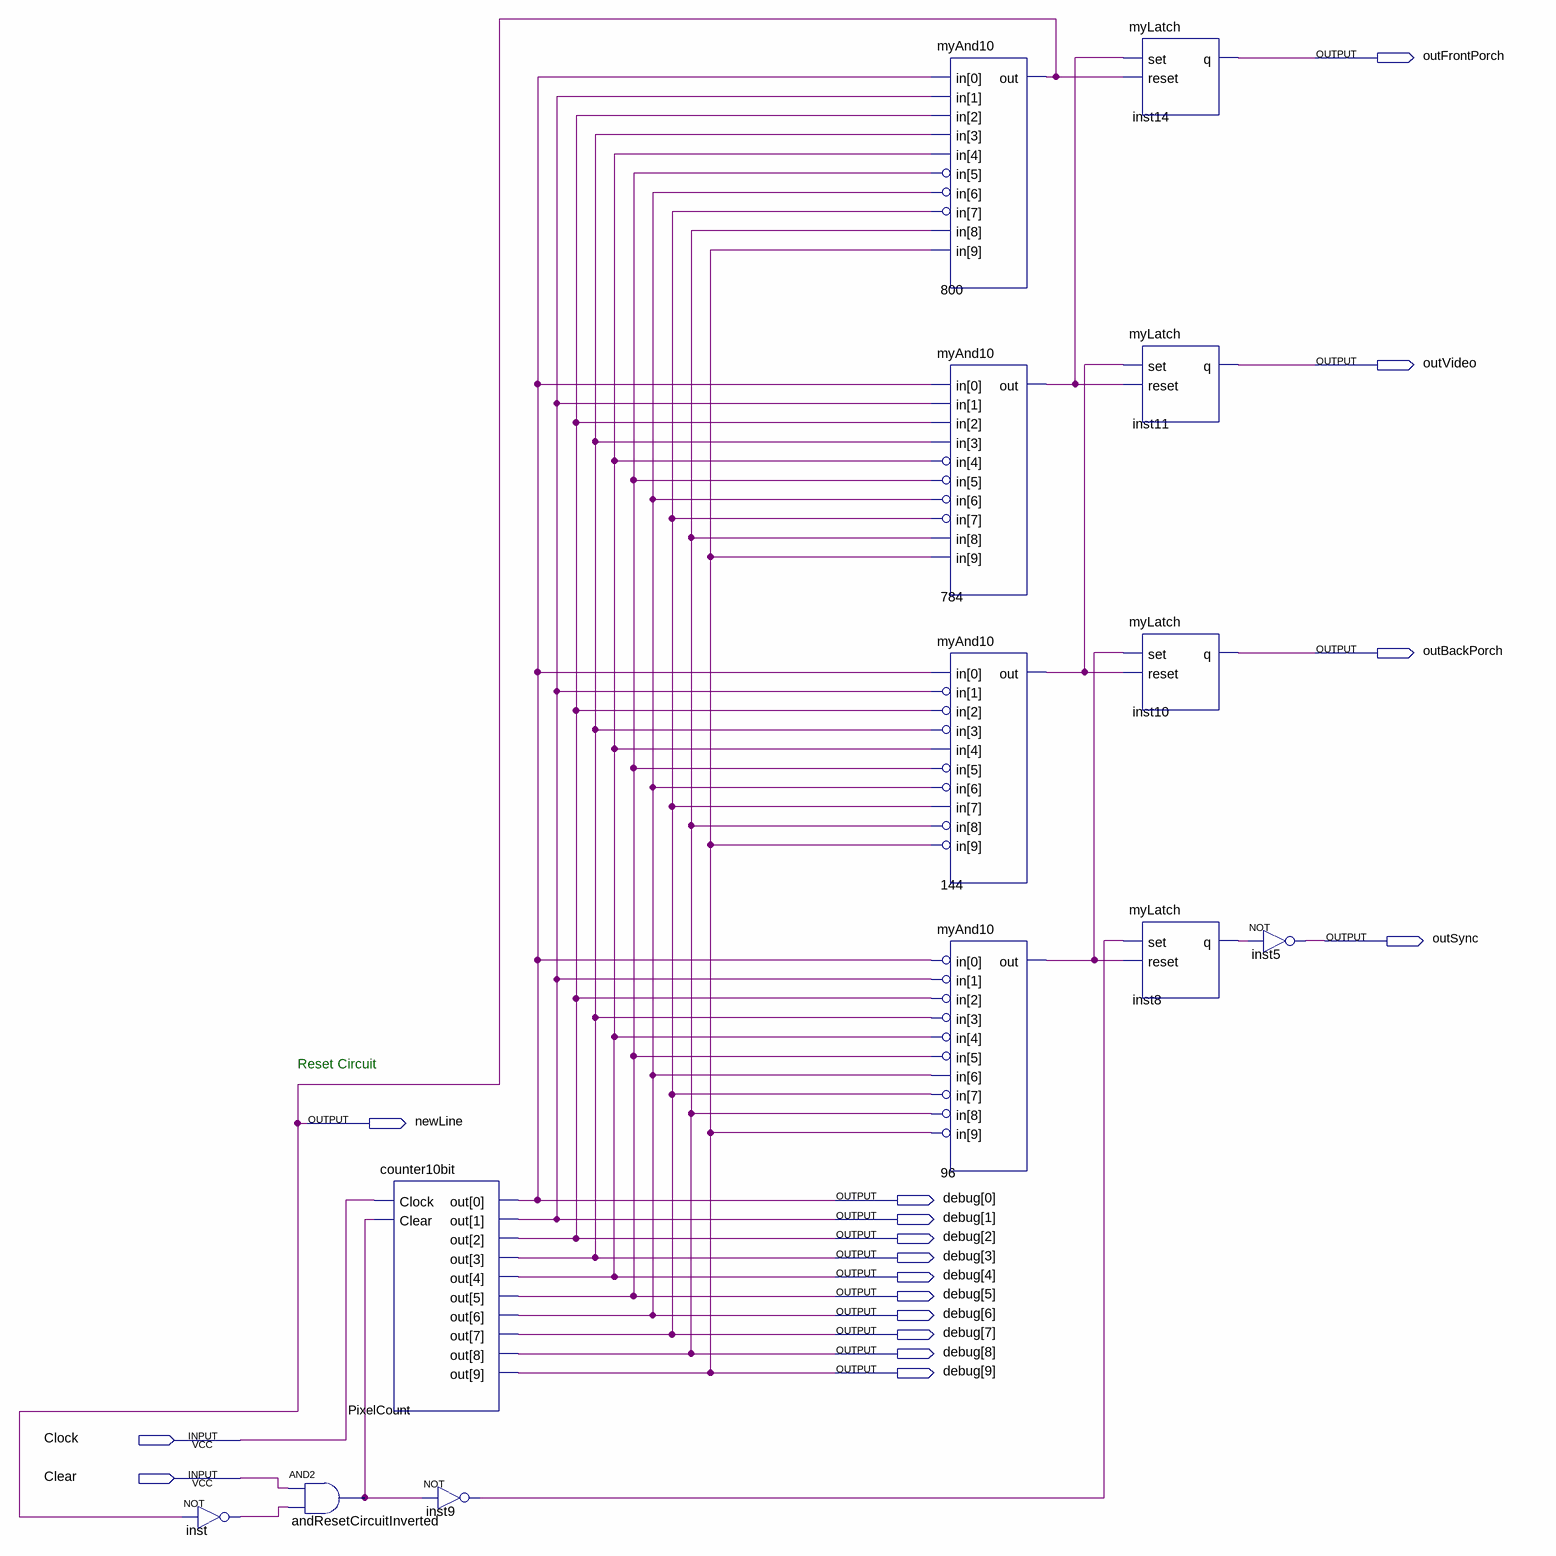
[diagram p0: schematic sheet]
// Quartus schematic counterHorizontalSync.bdf as structural Verilog: 13 symbols, 17 pins
module counterHorizontalSync (
  input  Clock,
  input  Clear,
  output outFrontPorch,
  output outVideo,
  output outBackPorch,
  output outSync,
  output newLine,
  output [9:0] debug
);

  wire andResetCircuitInverted_out, inst8_q, inst9_out, inst_out, n96_out, n144_out, n784_out;

  not inst (inst_out, newLine);
  and andResetCircuitInverted (andResetCircuitInverted_out, Clear, inst_out);
  counter10bit PixelCount (.Clock(Clock), .Clear(andResetCircuitInverted_out), .out(debug));
  not inst9 (inst9_out, andResetCircuitInverted_out);
  myAnd10 u_800 (.in(debug), .out(newLine));
  myAnd10 u_784 (.in(debug), .out(n784_out));
  myAnd10 u_144 (.in(debug), .out(n144_out));
  myAnd10 u_96 (.in(debug), .out(n96_out));
  myLatch inst14 (.set(n784_out), .reset(newLine), .q(outFrontPorch));
  myLatch inst11 (.set(n144_out), .reset(n784_out), .q(outVideo));
  myLatch inst10 (.set(n96_out), .reset(n144_out), .q(outBackPorch));
  myLatch inst8 (.set(inst9_out), .reset(n96_out), .q(inst8_q));
  not inst5 (outSync, inst8_q);

  // Notes on the sheet:
  //   Reset Circuit
endmodule
